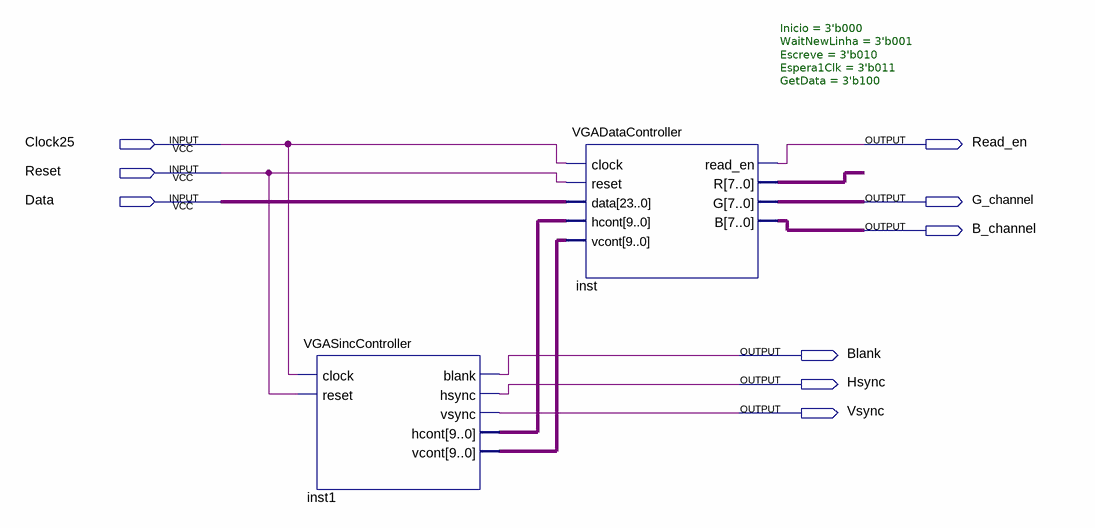
[diagram p0: schematic sheet]
// Quartus schematic VGAController.bdf as structural Verilog: 2 symbols, 9 pins
module VGAController (
  input  Clock25,
  input  Reset,
  input  Data,
  output Read_en,
  output G_channel,
  output B_channel,
  output Blank,
  output Hsync,
  output Vsync
);

  wire [7:0] inst_b, inst_g, inst_r;
  wire [9:0] inst1_hcont, inst1_vcont;
  wire [23:0] undriven;

  VGASincController inst1 (
    .clock(Clock25), .reset(Reset), .blank(Blank), .hsync(Hsync), .vsync(Vsync), .hcont(inst1_hcont),
    .vcont(inst1_vcont));
  VGADataController #(.Inicio(3'b000), .WaitNewLinha(3'b001), .Escreve(3'b010), .Espera1Clk(3'b011), .GetData(3'b100)) inst (
    .clock(Clock25), .reset(Reset), .data(undriven), .hcont(inst1_hcont), .vcont(inst1_vcont),
    .read_en(Read_en), .R(inst_r), .G(inst_g), .B(inst_b));
endmodule
